# Altium schematic sheet TUDSSL_condenar__Hardware_PCBs_Misc_Apo4devkit2COM50_Schematic1__2_LCD.schdoc
size 309 x 223 mm; Symbol: Sheet-Symbol_A4; Device: Sheet-Symbol_A4; Company: EasyEDA.com; Drawed: EasyEDA Pro; Reviewed: EasyEDA Pro; Version: V0.1; Page Size: A4; @Project Name: TUD-EnergyHarvestingConsole_2022-08-29_17-01-09; @Page Count: 4; @Update Date: 2022-11-22; @Create Date: 2022-11-20; @Schematic Name: Schematic1; Part Number: JLCPCB-002; @Page No: 3; @Page Name: LCD
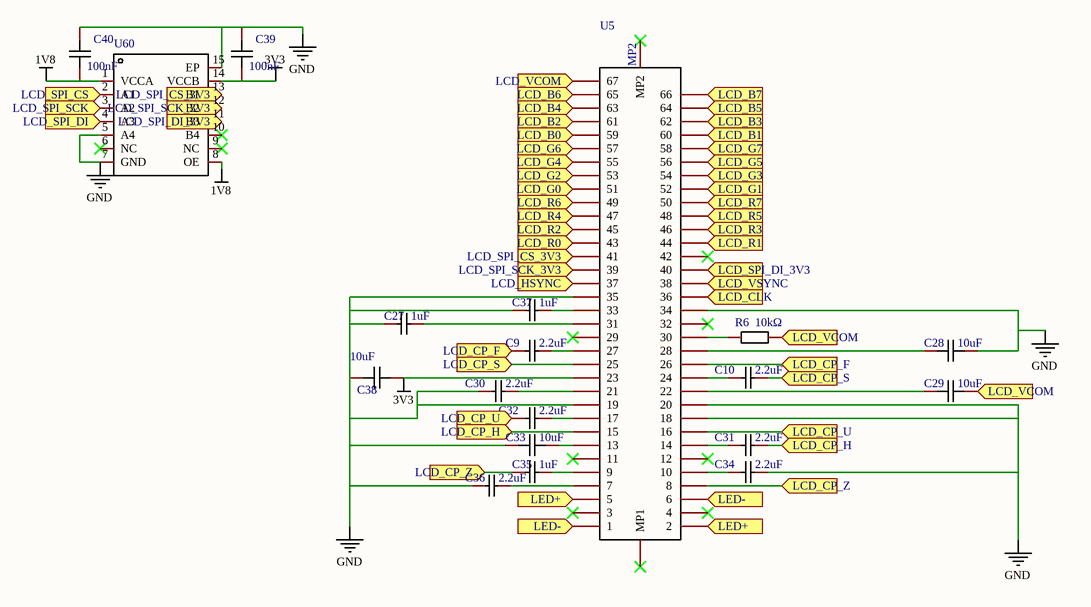
[diagram p0: TUDSSL_condenar__Hardware_PCBs_Misc_Apo4devkit2COM50_Schematic1__2_LCD.schdoc]

## Parts
C9  value 2.2uF  [C0603]  (hidden comment: CL10A225KO8NNNC)
C10  value 2.2uF  [C0603]  (hidden comment: CL10A225KO8NNNC)
C27  value 1uF  [C0603]  (hidden comment: CL10A105KB8NNNC)
C28  value 10uF  [C0603]  (hidden comment: CL10A106MA8NRNC)
C29  value 10uF  [C0603]  (hidden comment: CL10A106MA8NRNC)
C30  value 2.2uF  [C0603]  (hidden comment: CL10A225KO8NNNC)
C31  value 2.2uF  [C0603]  (hidden comment: CL10A225KO8NNNC)
C32  value 2.2uF  [C0603]  (hidden comment: CL10A225KO8NNNC)
C33  value 10uF  [C0603]  (hidden comment: CL10A106MA8NRNC)
C34  value 2.2uF  [C0603]  (hidden comment: CL10A225KO8NNNC)
C35  value 1uF  [C0603]  (hidden comment: CL10A105KB8NNNC)
C36  value 2.2uF  [C0603]  (hidden comment: CL10A225KO8NNNC)
C37  value 1uF  [C0603]  (hidden comment: CL10A105KB8NNNC)
C38  value 10uF  [C0603]  (hidden comment: CL10A106MA8NRNC)
C39  value 100nF  [C0603]  (hidden comment: CC0603KRX7R9BB104)
C40  value 100nF  [C0603]  (hidden comment: CC0603KRX7R9BB104)
R6  value 10kΩ  [R0603]  (hidden comment: 0603WAF1002T5E)
U5  NUMBER: MP2  (hidden comment: FH26G-67S-0.3SHBW_05_)
U60  TXB0104RGYR  [VQFN-14_L3.5-W3.5-P0.50-BL-EP]  (value not drawn)

## Ports
LCD_B0 (in), LCD_B1 (in), LCD_B2 (in), LCD_B3 (in), LCD_B4 (in), LCD_B5 (in), LCD_B6 (in), LCD_B7 (in), LCD_CLK (in), LCD_CP_F (in), LCD_CP_H (in), LCD_CP_S (in), LCD_CP_U (in), LCD_CP_Z (in), LCD_G0 (in), LCD_G1 (in), LCD_G2 (in), LCD_G3 (in), LCD_G4 (in), LCD_G5 (in), LCD_G6 (in), LCD_G7 (in), LCD_HSYNC (in), LCD_R0 (in), LCD_R1 (in), LCD_R2 (in), LCD_R3 (in), LCD_R4 (in), LCD_R5 (in), LCD_R6 (in), LCD_R7 (in), LCD_SPI_CS (in), LCD_SPI_CS_3V3 (in), LCD_SPI_DI (in), LCD_SPI_DI_3V3 (in), LCD_SPI_SCK (in), LCD_SPI_SCK_3V3 (in), LCD_VCOM (in), LCD_VSYNC (in), LED+ (in), LED- (in)

## Nets
1V8: C40.1 U60.1(VCCA) U60.8(OE)
3V3: C38.1 C39.1 U5.?23(23) U60.14(VCCB)
GND: C27.2 C28.1 C30.1 C33.2 C34.2 C36.1 C37.2 C38.2 C39.2 C40.2 U5.?18(18) U5.?19(19) U5.?20(20) U5.?34(34) U5.?35(35) U60.5(A4) U60.7(GND) U60.15(EP)
LCD_B0: U5.?59(59) ; port LCD_B0
LCD_B1: U5.?60(60) ; port LCD_B1
LCD_B2: U5.?61(61) ; port LCD_B2
LCD_B3: U5.?62(62) ; port LCD_B3
LCD_B4: U5.?63(63) ; port LCD_B4
LCD_B5: U5.?64(64) ; port LCD_B5
LCD_B6: U5.?65(65) ; port LCD_B6
LCD_B7: U5.?66(66) ; port LCD_B7
LCD_CLK: U5.?36(36) ; port LCD_CLK
LCD_CP_F: C9.1 U5.?26(26) ; port LCD_CP_F
LCD_CP_H: C31.2 U5.?15(15) ; port LCD_CP_H
LCD_CP_S: C10.2 U5.?25(25) ; port LCD_CP_S
LCD_CP_U: C32.1 U5.?16(16) ; port LCD_CP_U
LCD_CP_Z: C35.2 U5.?8(8) ; port LCD_CP_Z
LCD_G0: U5.?51(51) ; port LCD_G0
LCD_G1: U5.?52(52) ; port LCD_G1
LCD_G2: U5.?53(53) ; port LCD_G2
LCD_G3: U5.?54(54) ; port LCD_G3
LCD_G4: U5.?55(55) ; port LCD_G4
LCD_G5: U5.?56(56) ; port LCD_G5
LCD_G6: U5.?57(57) ; port LCD_G6
LCD_G7: U5.?58(58) ; port LCD_G7
LCD_HSYNC: U5.?37(37) ; port LCD_HSYNC
LCD_R0: U5.?43(43) ; port LCD_R0
LCD_R1: U5.?44(44) ; port LCD_R1
LCD_R2: U5.?45(45) ; port LCD_R2
LCD_R3: U5.?46(46) ; port LCD_R3
LCD_R4: U5.?47(47) ; port LCD_R4
LCD_R5: U5.?48(48) ; port LCD_R5
LCD_R6: U5.?49(49) ; port LCD_R6
LCD_R7: U5.?50(50) ; port LCD_R7
LCD_SPI_CS: U60.2(A1) ; port LCD_SPI_CS
LCD_SPI_CS_3V3: U5.?41(41) U60.13(B1) ; port LCD_SPI_CS_3V3
LCD_SPI_DI: U60.4(A3) ; port LCD_SPI_DI
LCD_SPI_DI_3V3: U5.?40(40) U60.11(B3) ; port LCD_SPI_DI_3V3
LCD_SPI_SCK: U60.3(A2) ; port LCD_SPI_SCK
LCD_SPI_SCK_3V3: U5.?39(39) U60.12(B2) ; port LCD_SPI_SCK_3V3
LCD_VCOM: C29.1 R6.2 U5.?67(67) ; port LCD_VCOM
LCD_VSYNC: U5.?38(38) ; port LCD_VSYNC
LED+: U5.?2(2) U5.?5(5) ; port LED+
LED-: U5.?1(1) U5.?6(6) ; port LED-
NetC9_2: C9.2 U5.?27(27)
NetC10_1: C10.1 U5.?24(24)
NetC27_1: C27.1 U5.?31(31)
NetC28_2: C28.2 U5.?28(28)
NetC29_2: C29.2 U5.?22(22)
NetC30_2: C30.2 U5.?21(21)
NetC31_1: C31.1 U5.?14(14)
NetC32_2: C32.2 U5.?17(17)
NetC33_1: C33.1 U5.?13(13)
NetC34_1: C34.1 U5.?10(10)
NetC35_1: C35.1 U5.?9(9)
NetC36_2: C36.2 U5.?7(7)
NetC37_1: C37.1 U5.?33(33)
NetR6_1: R6.1 U5.?30(30)

Not connected (* = marked no-connect by the designer): U5 ?3(3)* ?4(4)* ?11(11)* ?12(12)* ?29(29)* ?32(32)* ?42(42)* ?68(MP1)* ?69(MP2)*; U60 6(NC)* 9(NC)* 10(B4)*

## Notes on the sheet
- 1
- 2
- 3
- 4
- 5
- 6
- A
- B
- C
- Schematic
- Schematic1
- Create Date
- Update Date
- 2022-11-22
- 2022-11-20
- Reviewed
- Drawed
- Page
- EasyEDA Pro
- LCD
- Part Number
- TUD-EnergyHarvestingConsole_2022-08-29_17-01-09
- JLCPCB-002
- D
- VER
- SIZE
- PAGE
- OF
- V0.1
- A4
- EasyEDA.com

## Library data of the parts
C9 C10 C30-C32 C34 C36 = CL10A225KO8NNNC: Temperature Coefficient: Capacitance: Tolerance: Tolerance: Voltage Rated:; Manufacturer: SAMSUNG(三星); Add into BOM: yes; Name: 2.2uF; Symbol: CL10A225KO8NNNC; Device: CL10A225KO8NNNC; LCSC Part Name: 2.2uF(225) ±10% 16V; Supplier Part: C23630; Manufacturer Part: CL10A225KO8NNNC; Supplier Footprint: 0603; JLCPCB Part Class: Basic Part; Datasheet: https://atta.szlcsc.com/upload/public/pdf/source/20160103/1457707709512.pdf; Supplier: LCSC; Convert to PCB: yes
C27 C35 C37 = CL10A105KB8NNNC: Temperature Coefficient: Tolerance: Tolerance: Voltage Rated: Capacitance:; Manufacturer: SAMSUNG(三星); Add into BOM: yes; Name: 1uF; Symbol: CL10A105KB8NNNC; Device: CL10A105KB8NNNC; LCSC Part Name: 1uF(105) ±10% 50V; Supplier Part: C15849; Manufacturer Part: CL10A105KB8NNNC; Supplier Footprint: 0603; JLCPCB Part Class: Basic Part; Datasheet: https://atta.szlcsc.com/upload/public/pdf/source/20160103/1457707679084.pdf; Supplier: LCSC; Convert to PCB: yes
C28 C29 C33 C38 = CL10A106MA8NRNC: Capacitance: Tolerance:±20% Tolerance:±20% Voltage Rated: Temperature Coefficient:; Manufacturer: SAMSUNG(三星); Add into BOM: yes; Tolerance: ±20%; Name: 10uF; Symbol: CL10A106MA8NRNC; Device: CL10A106MA8NRNC; LCSC Part Name: 10uF ±20% 25V; Supplier Part: C96446; Manufacturer Part: CL10A106MA8NRNC; Supplier Footprint: 0603; JLCPCB Part Class: Basic Part; Datasheet: https://atta.szlcsc.com/upload/public/pdf/source/20170325/1490427913016.pdf; Supplier: LCSC; Convert to PCB: yes
C39 C40 = CC0603KRX7R9BB104: Capacitance: Tolerance:±10% Tolerance:±10% Voltage Rated: Temperature Coefficient:; Manufacturer: YAGEO(国巨); Add into BOM: yes; Tolerance: ±10%; Name: 100nF; Symbol: CC0603KRX7R9BB104; Device: CC0603KRX7R9BB104; LCSC Part Name: 100nF ±10% 50V; Supplier Part: C14663; Manufacturer Part: CC0603KRX7R9BB104; Supplier Footprint: 0603; JLCPCB Part Class: Basic Part; Datasheet: https://atta.szlcsc.com/upload/public/pdf/source/20170116/1484561234239.pdf; Supplier: LCSC; Convert to PCB: yes
R6 = 0603WAF1002T5E: Type:Thick Film Resistors Resistance: Tolerance:±1% Tolerance:±1% Power(Watts): Temperature Coefficient:±100ppm/ Temperature Coefficient:±100ppm/ Overload Voltage (Max): Operating Temperature Range:-55~+155 Operating Temperature Range:-55~+155; Manufacturer: UNI-ROYAL(厚声); Add into BOM: yes; Tolerance: ±1%; Name: 10kΩ; Symbol: 0603WAF1002T5E; Device: 0603WAF1002T5E; LCSC Part Name: 10kΩ ±1% 100mW; Supplier Part: C25804; Manufacturer Part: 0603WAF1002T5E; Supplier Footprint: 0603; JLCPCB Part Class: Basic Part; Datasheet: https://atta.szlcsc.com/upload/public/pdf/source/20200306/C422600_1E6D84923E4A46A82E41ADD87F860B5C.pdf; Supplier: LCSC; Convert to PCB: yes; Type: Thick Film Resistors; Temperature Coefficient: ±100ppm/; Operating Temperature Range: -55~+155
U5 = FH26G-67S-0.3SHBW_05_: Add into BOM: yes; Symbol: FH26G-67S-0.3SHBW_05_; Device: FH26G-67S-0.3SHBW_05_; Convert to PCB: yes
U60 = TXB0104RGYR: Translator Type:Voltage Levels Channel Type:Bi-Directional Number of Circuits:1 Channels per Circuit:4 Supply Voltage (VCCA):1.2V~3.6V Supply Voltage (VCCB):1.65V~5.5V Input Signal:- Output Signal:- Output Type:Tri-State，非反相 Data Rate:100Mbps Operating Te; Manufacturer: TI(德州仪器); Add into BOM: yes; Number of Circuits: 1; Channels per Circuit: 4; Name: TXB0104RGYR; Symbol: TXB0104RGYR; Device: TXB0104RGYR; LCSC Part Name: TXB0104RGYR; Supplier Part: C400708; Manufacturer Part: TXB0104RGYR; Supplier Footprint: VQFN-14; JLCPCB Part Class: Extended Part; Datasheet: https://atta.szlcsc.com/upload/public/pdf/source/20190627/C400708_E209323CD93C7CDCFD84DB9B403DAC13.pdf; Supplier: LCSC; Convert to PCB: yes; Translator Type: Voltage Levels; Channel Type: Bi-Directional; Supply Voltage (VCCA): 1.2V~3.6V; Supply Voltage (VCCB): 1.65V~5.5V; Input Signal: -; Output Signal: -; Output Type: Tri-State，非反相; Data Rate: 100Mbps; Operating Temperature: -40~+85; Features: 自动方向检测